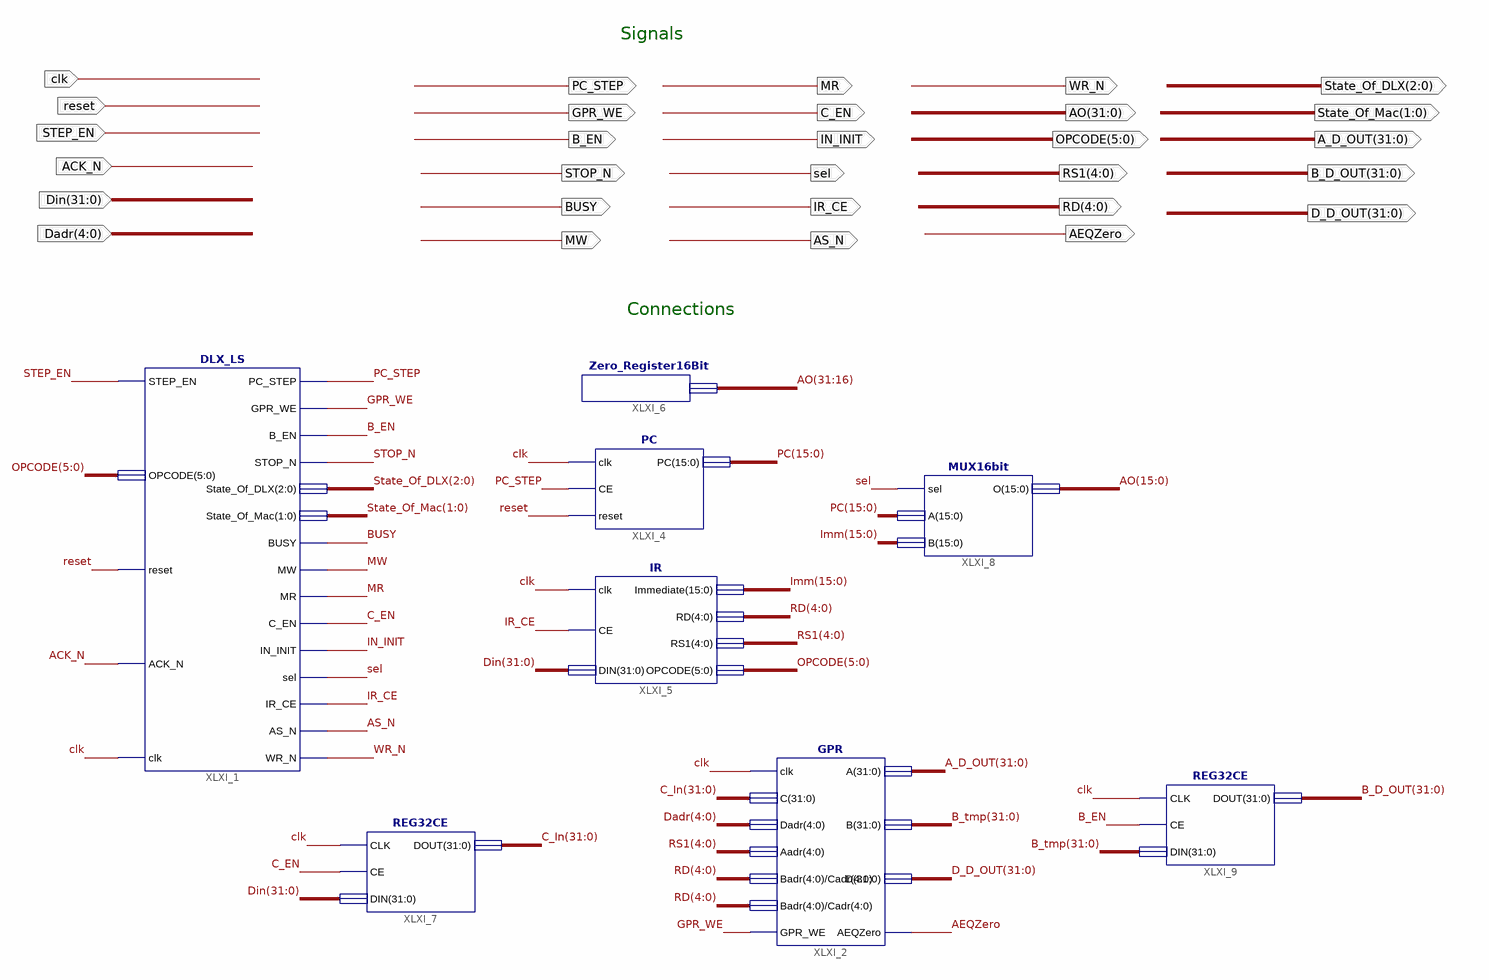
[diagram p0: schematic sheet 1]
// Xilinx ISE schematic Data_Path.sch (spartan6) as structural Verilog: 8 symbols, 29 ports
module Data_Path (
  input  [31:0] Din,
  input  [4:0] Dadr,
  input  STEP_EN,
  input  reset,
  input  ACK_N,
  input  clk,
  output MR,
  output [1:0] State_Of_Mac,
  output [31:0] AO,
  output PC_STEP,
  output GPR_WE,
  output B_EN,
  output STOP_N,
  output [2:0] State_Of_DLX,
  output BUSY,
  output MW,
  output C_EN,
  output IN_INIT,
  output sel,
  output IR_CE,
  output AS_N,
  output WR_N,
  output [4:0] RD,
  output [4:0] RS1,
  output [5:0] OPCODE,
  output [31:0] A_D_OUT,
  output AEQZero,
  output [31:0] B_D_OUT,
  output [31:0] D_D_OUT
);

  wire [15:0] Imm, PC;
  wire [31:0] B_tmp, C_In;

  MUX16bit XLXI_8 (.sel(sel), .A(PC), .B(Imm), .O(AO[15:0]));
  PC XLXI_4 (.clk(clk), .CE(PC_STEP), .reset(reset), .PC(PC));
  IR XLXI_5 (.clk(clk), .CE(IR_CE), .DIN(Din), .Immediate(Imm), .RD(RD), .RS1(RS1), .OPCODE(OPCODE));
  REG32CE XLXI_9 (.CLK(clk), .CE(B_EN), .DIN(B_tmp), .DOUT(B_D_OUT));
  GPR XLXI_2 (
    .clk(clk), .C(C_In), .Dadr(Dadr), .Aadr(RS1), .Badr(RD), .Cadr(RD), .GPR_WE(GPR_WE), .A(A_D_OUT),
    .B(B_tmp), .D(D_D_OUT), .AEQZero(AEQZero));
  REG32CE XLXI_7 (.CLK(clk), .CE(C_EN), .DIN(Din), .DOUT(C_In));
  Zero_Register16Bit XLXI_6 (.Zero_Out(AO[31:16]));
  DLX_LS XLXI_1 (
    .STEP_EN(STEP_EN), .OPCODE(OPCODE), .reset(reset), .ACK_N(ACK_N), .clk(clk), .PC_STEP(PC_STEP),
    .GPR_WE(GPR_WE), .B_EN(B_EN), .STOP_N(STOP_N), .State_Of_DLX(State_Of_DLX), .State_Of_Mac(State_Of_Mac),
    .BUSY(BUSY), .MW(MW), .MR(MR), .C_EN(C_EN), .IN_INIT(IN_INIT), .sel(sel), .IR_CE(IR_CE), .AS_N(AS_N),
    .WR_N(WR_N));

  // Notes on the sheet:
  //   Signals
  //   Connections
endmodule
